# Altium schematic sheet sch.SchDoc: Full wave uncontrolled rectifier
size A; Author: Kirollous Mahrous; CompanyName: Alex University; DrawnBy: Kirollous Mahrous; DocumentNumber: 1; SheetNumber: 1; SheetTotal: 1
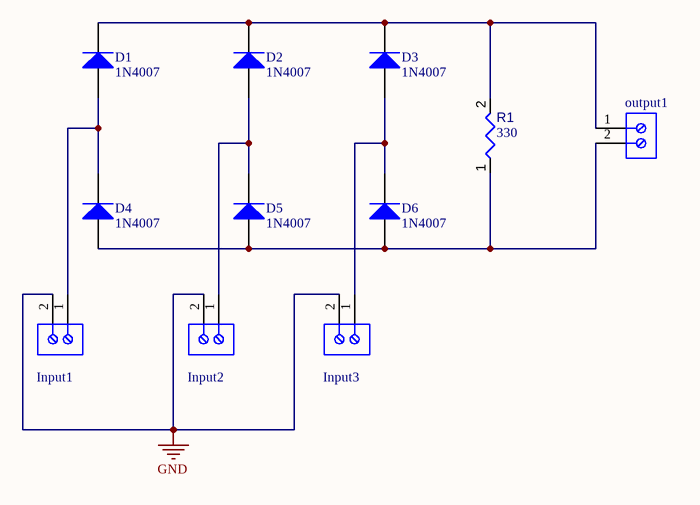
[diagram p0: sch.SchDoc]

## Parts
D1  1N4007  [FAIR-DO-41-2]
D2  1N4007  [FAIR-DO-41-2]
D3  1N4007  [FAIR-DO-41-2]
D4  1N4007  [FAIR-DO-41-2]
D5  1N4007  [FAIR-DO-41-2]
D6  1N4007  [FAIR-DO-41-2]
Input1  691137710002  [terminals]  (value not drawn)
Input2  691137710002  [terminals]  (value not drawn)
Input3  691137710002  [terminals]  (value not drawn)
output1  691137710002  [terminals]  (value not drawn)
R1  value 330  [RESA60-630X240]  (hidden comment: MFR-25FBF52-221R)

## Nets
GND: Input1.2 Input2.2 Input3.2
NetD1_1: D1.1(K) D2.1(K) D3.1(K) output1.1 R1.2
NetD1_2: D1.2(A) D4.1(K) Input1.1
NetD2_2: D2.2(A) D5.1(K) Input2.1
NetD3_2: D3.2(A) D6.1(K) Input3.1
NetD4_2: D4.2(A) D5.2(A) D6.2(A) output1.2 R1.1

## Library data of the parts
D1-D6 = CMP-004-00007-2: General Purpose Rectifier, 1.1 V, 1.0 A, -55 to 175 degC, 2-Pin DO-41, RoHS, Tape and Reel; Manufacturer: Fairchild; Peak Reverse Current: 5uA; Max Surge Current: 30A; Elements: 1; Forward Voltage: 1.1V; Package Version: Rev. 2, 09/2008; Forward Current: 1A; Package Quantity: 5000; Packaging: TapeandReel; Package URL: http://www.fairchildsemi.com/dwg/DO/DO41A.pdf; Manufacturer URL: https://www.fairchildsemi.com/; Package Reference: DO-41-2; Pins: 2; Min Operating Temperature: -55°C; Datasheet Version: Rev. 1.1.0, 11/2014; Max Operating Temperature: 175°C; RoHS Compliant: True; Case/Package: DO-41-2; Mounting Technology: TH; Package Description: 2-Pin Axial Lead, Dia 2.375 mm, Body Length 4.63 mm; Datasheet URL: https://www.fairchildsemi.com/datasheets/1N/1N4007.pdf
Input1-Input3 output1 = terminals: Series 1377 - 5.00 mm Horizontal Entry with Pressure Clamp WR-TBL, 2 pin; Manufacturer: Wurth Elektronik; Pin Number: 2; Pitch: 5.00mm; Operating Temperature: -30to120degC; Package Reference: 691137710002; Publisher: WurthElektronik; Mounting Technology: THT; Manufacturer URL: http://www.we-online.de; Packaging: Box; Part Number: 691137710002; Datasheet URL: http://katalog.we-online.de/pbs/datasheet/691137710002.pdf
R1 = CMP-009-00051-4: Axial Resistor, 221 Ohm, +/- 1%, 250 mW, -55 to 155 degC, 2-Pin THD, RoHS, Bulk; Manufacturer: Yageo; Power: 250mW; Voltage Rating: 250V; Package Quantity: 200; Manufacturer URL: http://www.yageo.com/; Case/Package: Axial; Package Reference: MFR-25; RoHS Compliant: True; Mounting Technology: TH; Datasheet URL: http://www.yageo.com/documents/recent/Yageo%20LR_MFR_2013.pdf; Packaging: Bulk; Package Description: 2-Pin Axial Lead, Dia 2.4 mm, Body Length 6.3 mm; Max Operating Temperature: 155°C; Tolerance: 1%; Datasheet Version: Apr-13; Min Operating Temperature: -55°C